# EAGLE schematic pic_pcb (EAGLE 7.5.0)
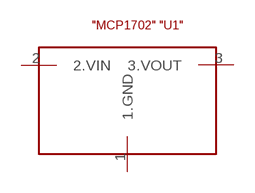
[diagram p0: schematic, sheet 1]

## Parts
U$1  MCP1702  [TO92]
Unconnected: U$1.1(1.GND) U$1.2(2.VIN) U$1.3(3.VOUT)

## Library data of the parts
U$1 = PIC32MX250F128B_PCB_library:MCP1702